# EAGLE design d-ampsch (EAGLE 9.5.2)

## Sheet 1 of 2: D-amp sch
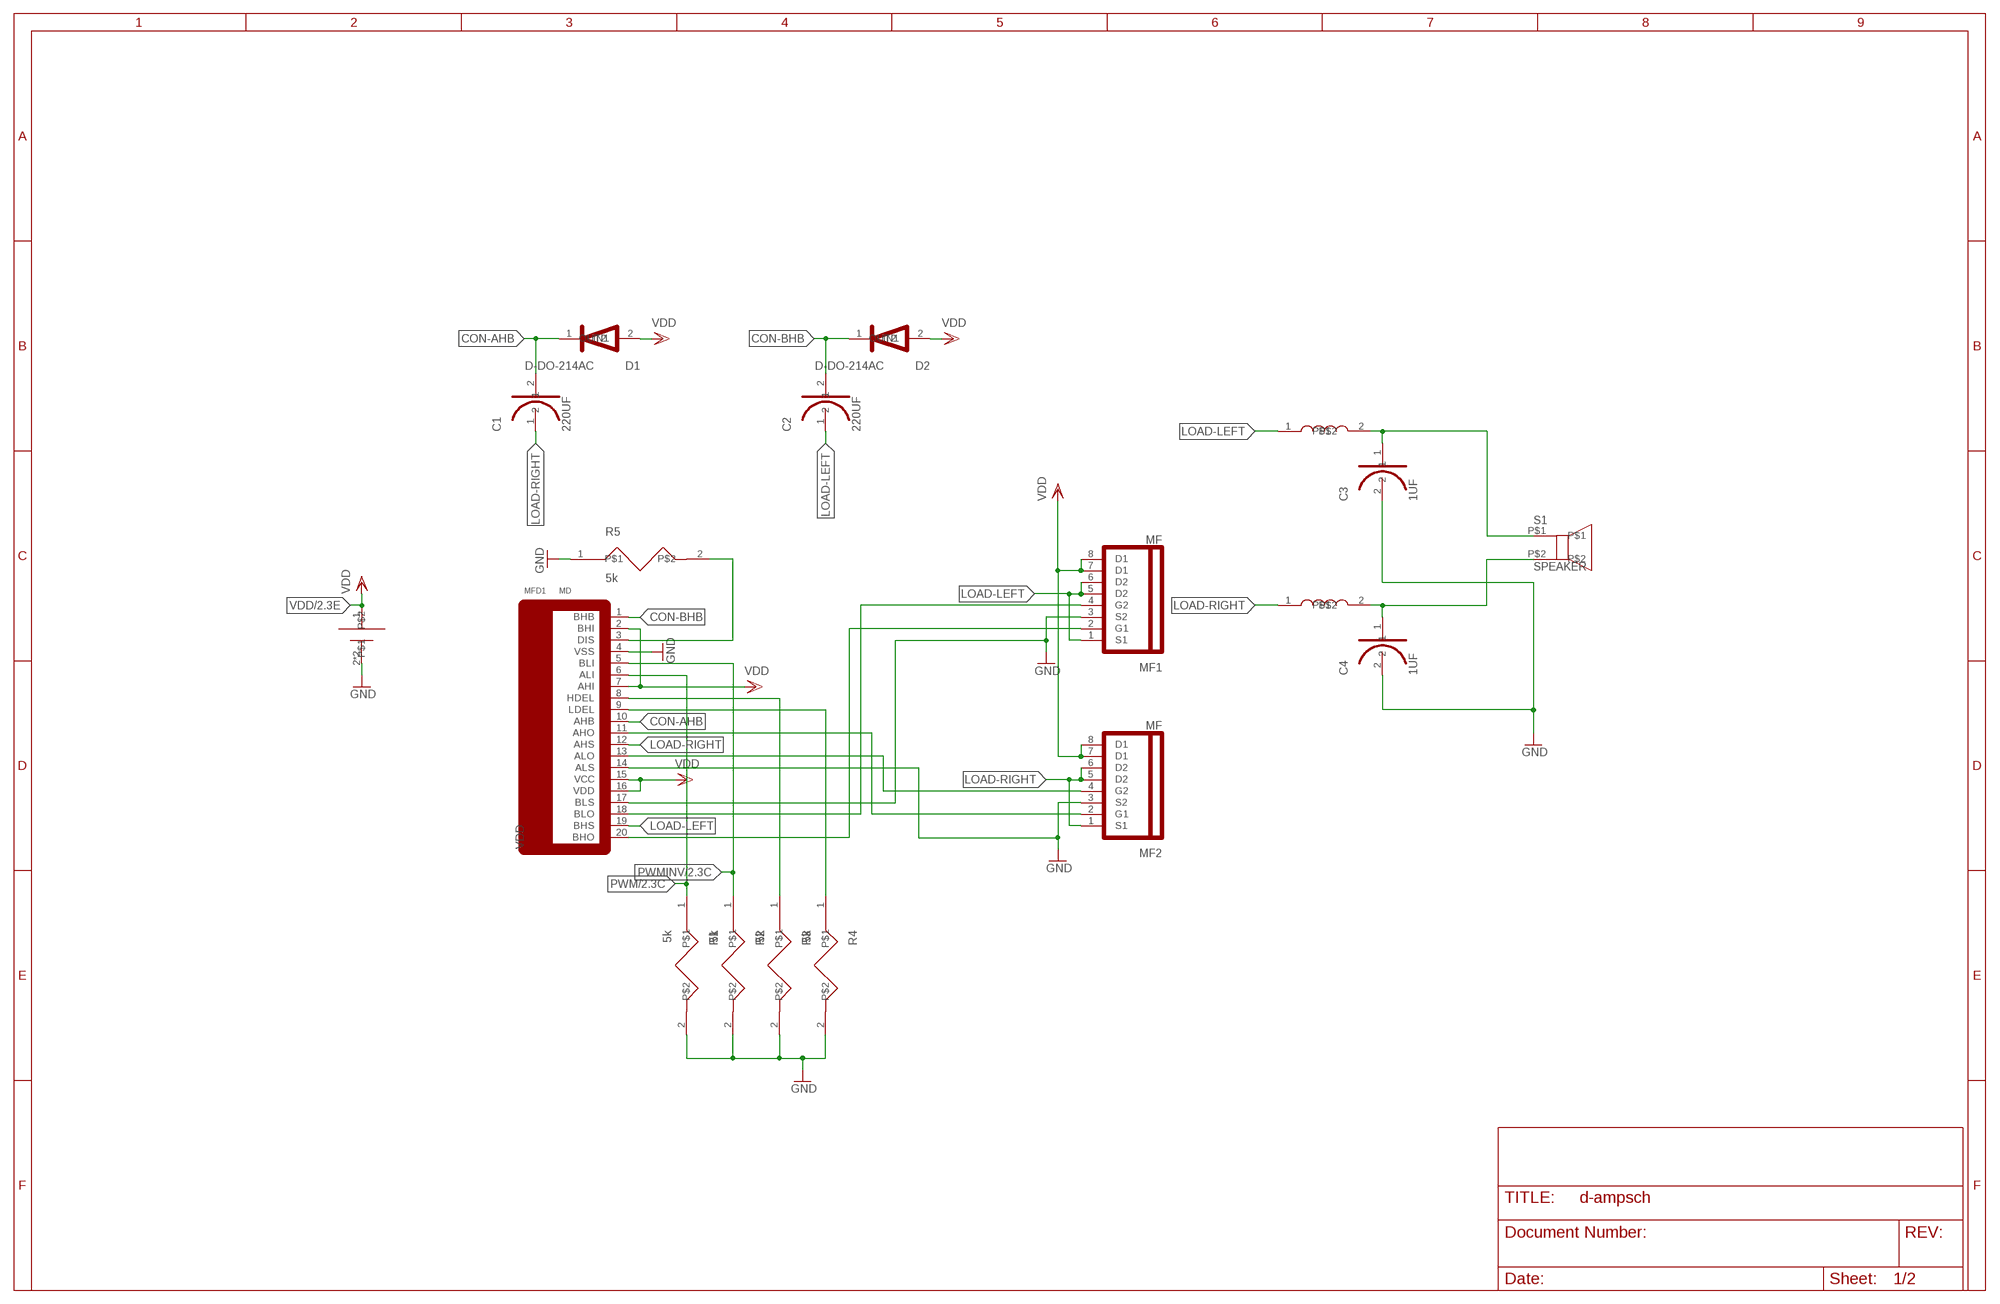
[diagram p0: schematic, sheet 1]

### Parts
C1  220UF  C-EEEFK1H221P-220UF  [CAPAE1030X1050N]
C2  220UF  C-EEEFK1H221P-220UF  [CAPAE1030X1050N]
C3  1UF  C-EEEHB1H1R0R-1UF  [CAPAE430X610N]
C4  1UF  C-EEEHB1H1R0R-1UF  [CAPAE430X610N]
D1  D-DO-214AC  [SOD5226X220N]
D2  D-DO-214AC  [SOD5226X220N]
MF1  MF  MF-PHN210T  [SOIC127P600X175-8N]
MF2  MF  MF-PHN210T  [SOIC127P600X175-8N]
MFD1  MD  MD-HIP4081AIBZ  [SOIC127P1032X265-20N]
R1  5k  R-RN73C2A4K99B-5K  [RESC2012X65N]
R2  5k  R-RN73C2A4K99B-5K  [RESC2012X65N]
R3  5k  R-RN73C2A4K99B-5K  [RESC2012X65N]
R4  5k  R-RN73C2A4K99B-5K  [RESC2012X65N]
R5  5k  R-RN73C2A4K99B-5K  [RESC2012X65N]
S1  SPEAKER  S-SPEAKER  [SPEAKER]
U$1  B-BATTERYBATTERYCONN  [DIODFN1710X1680X1100-3N]
U$21  I-WURTH-10UH  [INDDFN2751X2800X1540-3N]
U$22  I-WURTH-10UH  [INDDFN2751X2800X1540-3N]

### Nets
CON-AHB: C1.2 D1.1(IN1) MFD1.10(AHB)
CON-BHB: C2.2 D2.1(IN1) MFD1.1(BHB)
GND: C3.2 C4.2 MF1.3(S2) MF2.3(S2) MFD1.4(VSS) MFD1.14(ALS) MFD1.17(BLS) R1.2 R2.2 R3.2 R4.2 R5.1 U$1.2 U$1.3 ; also sheet 2
LOAD-LEFT: C2.1 MF1.1(S1) MF1.5(D2) MF1.6(D2) MFD1.19(BHS) U$21.1
LOAD-RIGHT: C1.1 MF2.1(S1) MF2.5(D2) MF2.6(D2) MFD1.12(AHS) U$22.1
N$1: MFD1.8(HDEL) R3.1
N$3: MFD1.9(LDEL) R4.1
N$5: MF1.2(G1) MFD1.20(BHO)
N$6: MF1.4(G2) MFD1.18(BLO)
N$7: MFD1.3(DIS) R5.2
N$8: C4.1 S1.P$2 U$22.2
N$9: MF2.2(G1) MFD1.11(AHO)
N$11: MF2.4(G2) MFD1.13(ALO)
N$12: C3.1 S1.P$1 U$21.2
PWM: MFD1.6(ALI) R1.1 ; also sheet 2
PWMINV: MFD1.5(BLI) R2.1 ; also sheet 2
VDD: D1.2(OUT2) D2.2(OUT2) MF1.7(D1) MF1.8(D1) MF2.7(D1) MF2.8(D1) MFD1.2(BHI) MFD1.7(AHI) MFD1.15(VCC) MFD1.16(VDD) U$1.1 ; also sheet 2

## Sheet 2 of 2: MCU BT SCH
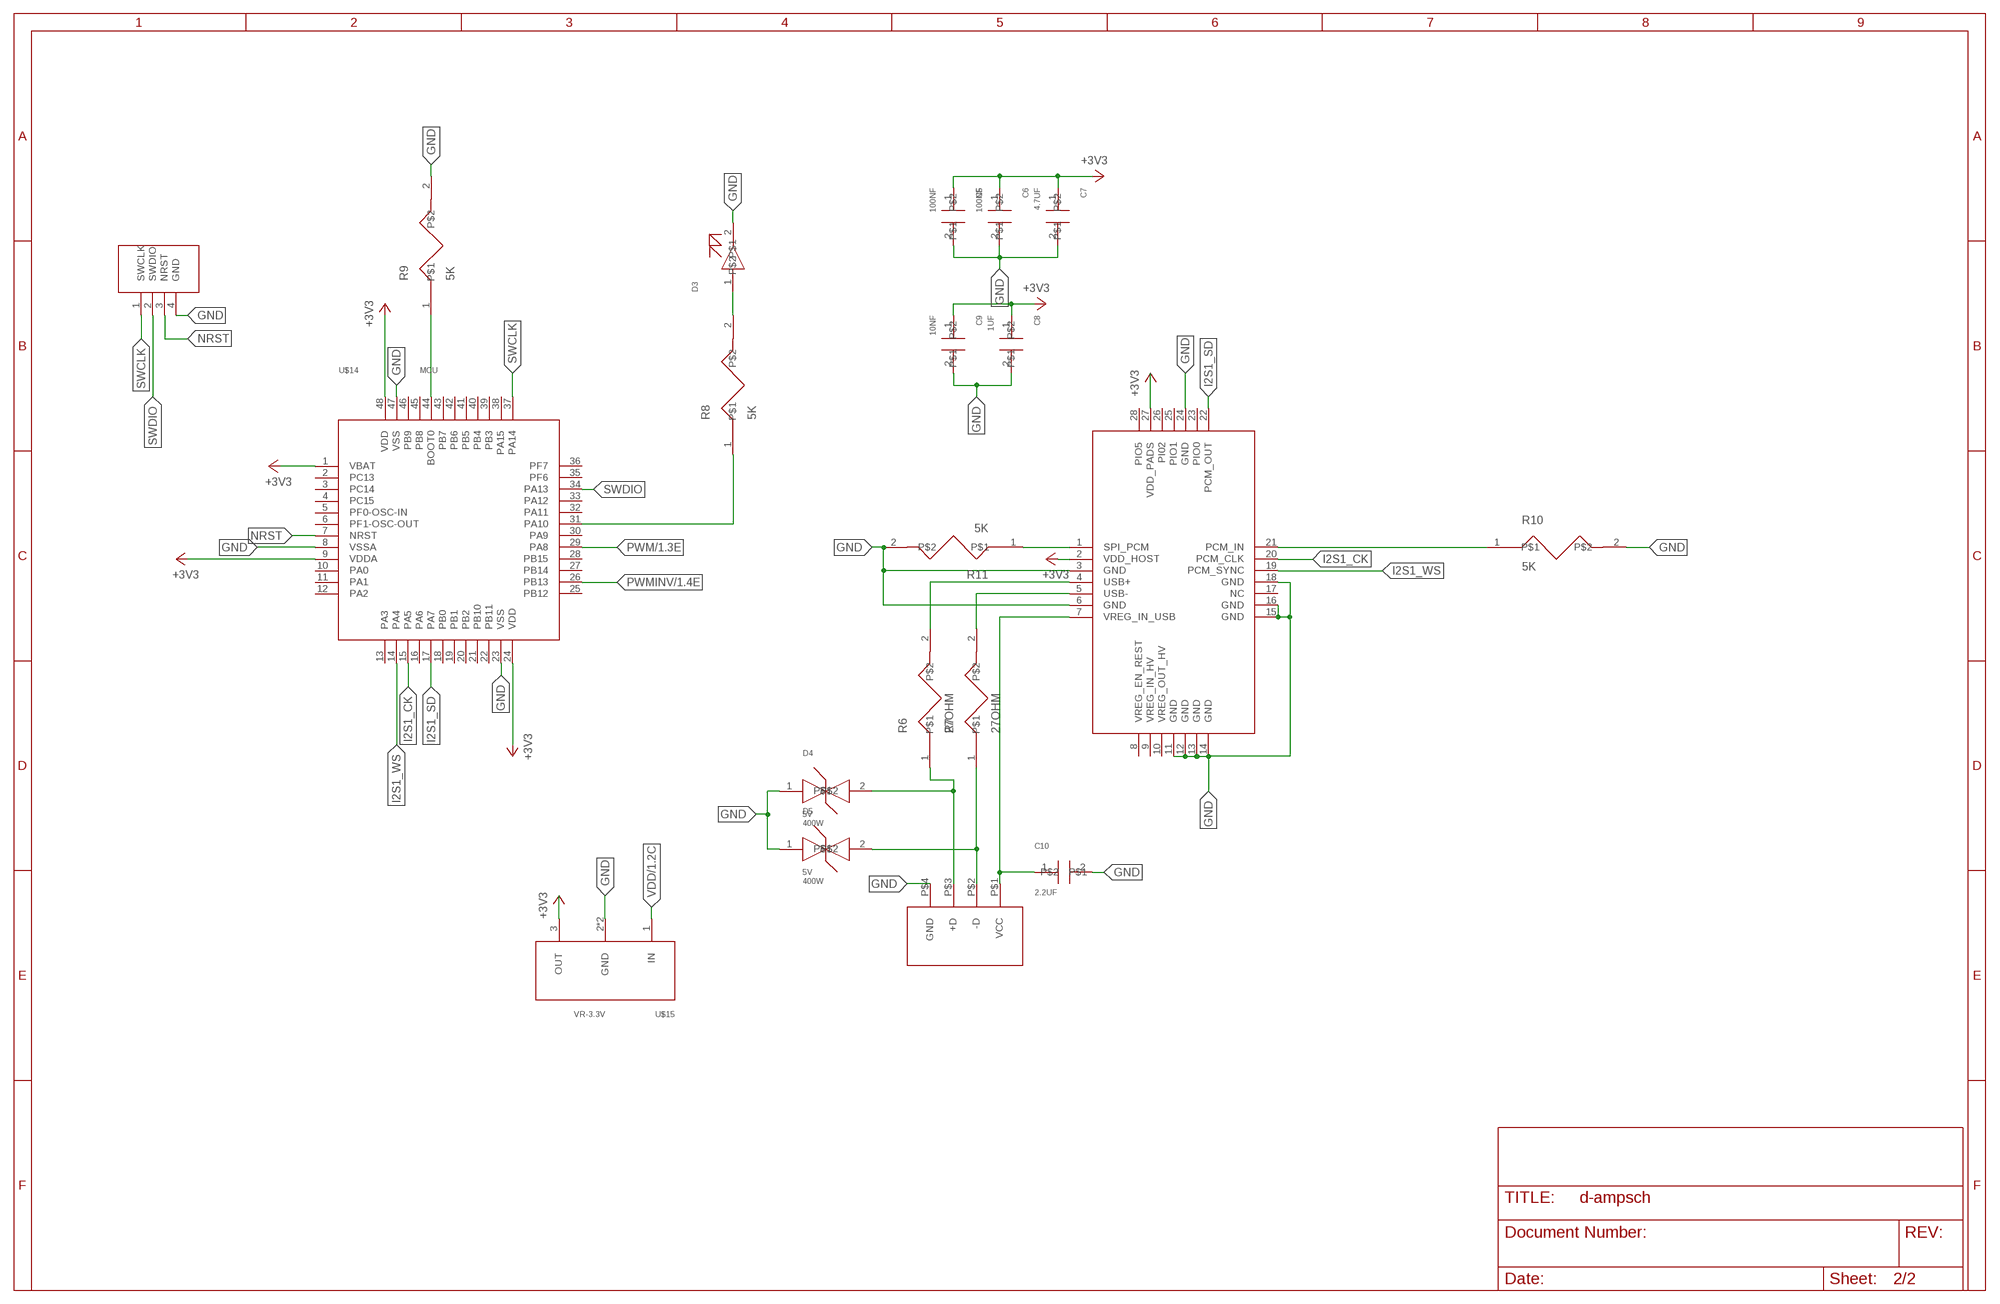
[diagram p1: schematic, sheet 2]

### Parts
C5  100NF  C-100NF  [CAPC2012X70N]
C6  100NF  C-100NF  [CAPC2012X70N]
C7  4.7UF  C-4.7UFC-4.7UF  [CAPC2012X145N]
C8  1UF  C-1UF-NPC-1UF-NP  [CAPC4532X70N]
C9  10NF  C-10NF  [CAPC2012X145N]
C10  2.2UF  CAP-2.2UF  [CAPC1632X100N]
D3  LED_GREEN  [LEDC3333X200N]
D4  BI-DIR-5V  [DIOM5126X229N]
D5  BI-DIR-5V  [DIOM5126X229N]
R6  27OHM  R-27OHM  [RESC2012X60N]
R7  27OHM  R-27OHM  [RESC2012X60N]
R8  5K  R-RN73C2A4K99B-5K  [RESC2012X65N]
R9  5K  R-RN73C2A4K99B-5K  [RESC2012X65N]
R10  5K  R-RN73C2A4K99B-5K  [RESC2012X65N]
R11  5K  R-RN73C2A4K99B-5K  [RESC2012X65N]
U$13  BLUETOOTH  [QFN80P850X1285X175-42N]
U$14  MCU  [QFP50P900X900X160-48N]
U$15  VR-3.3V  [SOT230P700X175-4N]
U$23  USB  [USB]
U$31  PROGRAMCONN  [HDRV4W50P200_1X4_840X220X710B]

### Nets
+3V3: C5.1 C6.1 C7.1 C8.1 C9.1 U$13.2(VDD_HOST) U$13.27(VDD_PADS) U$14.1(VBAT) U$14.9(VDDA) U$14.24(VDD) U$14.48(VDD) U$15.3(OUT)
GND: C5.2 C6.2 C7.2 C8.2 C9.2 C10.2 D3.2 D4.1 D5.1 R9.2 R10.2 R11.2 U$13.3(GND) U$13.6(GND) U$13.11(GND) U$13.12(GND) U$13.13(GND) U$13.14(GND) U$13.15(GND) U$13.16(GND) U$13.18(GND) U$13.24(GND) U$14.8(VSSA) U$14.23(VSS) U$14.47(VSS) U$15.2(GND) U$15.4(GND) U$23.P$4(GND) U$31.4(GND) ; also sheet 1
I2S1_CK: U$13.20(PCM_CLK) U$14.15(PA5)
I2S1_SD: U$13.22(PCM_OUT) U$14.17(PA7)
I2S1_WS: U$13.19(PCM_SYNC) U$14.14(PA4)
N$2: R11.1 U$13.1(SPI_PCM)
N$4: D4.2 R6.1 U$23.P$3(+D)
N$10: D5.2 R7.1 U$23.P$2(-D)
N$13: C10.1 U$13.7(VREG_IN_USB) U$23.P$1(VCC)
N$14: R7.2 U$13.5(USB-)
N$15: R6.2 U$13.4(USB+)
N$16: R10.1 U$13.21(PCM_IN)
N$17: R9.1 U$14.44(BOOT0)
N$18: D3.1 R8.2
N$19: R8.1 U$14.31(PA10)
NRST: U$14.7(NRST) U$31.3(NRST)
PWM: U$14.29(PA8) ; also sheet 1
PWMINV: U$14.26(PB13) ; also sheet 1
SWCLK: U$14.37(PA14) U$31.1(SWCLK)
SWDIO: U$14.34(PA13) U$31.2(SWDIO)
VDD: U$15.1(IN) ; also sheet 1
Unconnected: U$13.8(VREG_EN_REST) U$13.9(VREG_IN_HV) U$13.10(VREG_OUT_HV) U$13.17(NC) U$13.23(PIO0) U$13.25(PIO1) U$13.26(PI02) U$13.28(PIO5) U$14.2(PC13) U$14.3(PC14) U$14.4(PC15) U$14.5(PF0-OSC-IN) U$14.6(PF1-OSC-OUT) U$14.10(PA0) U$14.11(PA1) U$14.12(PA2) U$14.13(PA3) U$14.16(PA6) U$14.18(PB0) U$14.19(PB1) U$14.20(PB2) U$14.21(PB10) U$14.22(PB11) U$14.25(PB12) U$14.27(PB14) U$14.28(PB15) U$14.30(PA9) U$14.32(PA11) U$14.33(PA12) U$14.35(PF6) U$14.36(PF7) U$14.38(PA15) U$14.39(PB3) U$14.40(PB4) U$14.41(PB5) U$14.42(PB6) U$14.43(PB7) U$14.45(PB8) U$14.46(PB9)

## Library data of the parts
C1 C2 = amplib:C-EEEFK1H221P-220UF: EEEFK1H221P <https://docs.rs-online.com/919b/0900766b8139e2ba.pdf> RS-artikelnummer 537-0584 <https://se.rs-online.com/web/p/aluminium-capacitors/5370584/> 220uF
C3 C4 = amplib:C-EEEHB1H1R0R-1UF
C5 C6 = amplib:C-100NF: datasheet <https://docs.rs-online.com/af10/0900766b817076d9.pdf> RS-artikelnummer 264-4416 <https://se.rs-online.com/web/p/mlccs-multilayer-ceramic-capacitors/2644416/>
C7 = amplib:C-4.7UF: datasheet <https://docs.rs-online.com/c389/0900766b81714cd4.pdf> RS-artikelnummer 903-9105 <https://se.rs-online.com/web/p/mlccs-multilayer-ceramic-capacitors/9039105/>
C8 = amplib:C-1UF-NP: datasheet <https://docs.rs-online.com/72e0/0900766b80dc2409.pdf> RS-artikelnummer 698-3875 <https://se.rs-online.com/web/p/mlccs-multilayer-ceramic-capacitors/6983875/>
C9 = amplib:C-10NF: datasheet <https://docs.rs-online.com/9e65/0900766b8104796c.pdf> RS-artikelnummer 751-2226 <https://se.rs-online.com/web/p/mlccs-multilayer-ceramic-capacitors/7512226/>
C10 = amplib:CAP-2.2UF: datasheet <https://docs.rs-online.com/1d1a/0900766b815c8acd.pdf> RS-artikelnummer 144-1960 <https://se.rs-online.com/web/p/mlccs-multilayer-ceramic-capacitors/1441960/>
D1 D2 = amplib:D-DO-214AC: DO-214AC <https://docs.rs-online.com/8928/0900766b812212c7.pdf> RS-artikelnummer 781-1122 <https://se.rs-online.com/web/p/rectifier-diodes-schottky-diodes/7811122/>
D3 = amplib:LED_GREEN: datasheet <https://docs.rs-online.com/7395/0900766b812d394e.pdf> RS-artikelnummer 810-6822 <https://se.rs-online.com/web/p/leds/8106822/>
D4 D5 = amplib:BI-DIR-5V: datasheet <https://docs.rs-online.com/73d6/0900766b810f4edb.pdf> RS-artikelnummer 764-5568 <https://se.rs-online.com/web/p/tvs-diodes/7645568/>
MF1 MF2 = amplib:MF-PHN210T: PHN210T <https://www.renesas.com/eu/en/www/doc/datasheet/hip4081a.pdf> RS-artikelnummer 725-8376 <https://se.rs-online.com/web/p/mosfets/7258376/>
MFD1 = amplib:MD-HIP4081AIBZ: HIP4081AIBZ <https://www.renesas.com/eu/en/www/doc/datasheet/hip4081a.pdf> RS-artikelnummer 216-3484 <https://se.rs-online.com/web/p/mosfet-drivers/2163484/>
R1-R5 R8-R11 = amplib:R-RN73C2A4K99B-5K: datasheet <https://docs.rs-online.com/96b9/0900766b81488572.pdf> RS-artikelnummer 215-3162 <https://se.rs-online.com/web/p/surface-mount-fixed-resistors/2153162/>
R6 R7 = amplib:R-27OHM
S1 = amplib:S-SPEAKER
U$1 = amplib:B-BATTERY: acdcadapter, RS-artikelnummer 121-7132 <https://se.rs-online.com/web/p/ac-dc-adapters/1217132/> RS-artikelnummer 476-157 <https://se.rs-online.com/web/p/dc-power-sockets/0476157/> datasheet <https://docs.rs-online.com/560d/0900766b815825c1.pdf>
U$13 = amplib:BLUETOOTH: datasheet <https://www.mouser.se/datasheet/2/986/Datasheet_-_BT800_Module-1590704.pdf> Mouser No: 239-BT800 <https://www.mouser.se/ProductDetail/Laird-Connectivity/BT800?qs=sGAEpiMZZMsGelYiB%252BjhZkkHhaJQb1s%252BFpdjxxQrm%2FVzv2ACM1FW4w==>
U$14 = amplib:MCU: datasheet <https://www.mouser.se/datasheet/2/389/stm32f031c4-956179.pdf> Mouser No: 511-STM32F031C4T6 <https://www.mouser.se/ProductDetail/STMicroelectronics/STM32F031C4T6?qs=sGAEpiMZZMuoKKEcg8mMKJe7FkJ93gBlEVQCkIXRNi2EOhU3M8GXsA%3D%3D>
U$15 = amplib:VR-3.3V: datasheet <https://docs.rs-online.com/ddd1/0900766b813ed0b7.pdf> RS-artikelnummer 757-7190 <https://se.rs-online.com/web/p/linear-voltage-regulators/7577190/>
U$21 U$22 = amplib:I-WURTH-10UH
U$23 = amplib:USB: datasheet <https://docs.rs-online.com/0507/0900766b81711f60.pdf> RS-artikelnummer 909-7864 <https://se.rs-online.com/web/p/type-a-usb-connectors/9097864/>
U$31 = amplib:PROGRAMCONN: datasheet <https://docs.rs-online.com/9df3/0900766b80e352b0.pdf> RS-artikelnummer 701-9862 <https://se.rs-online.com/web/p/pcb-pin-socket-strips/7019862/>

## Net classes
0 default: clearance 0.205 mm

## Board
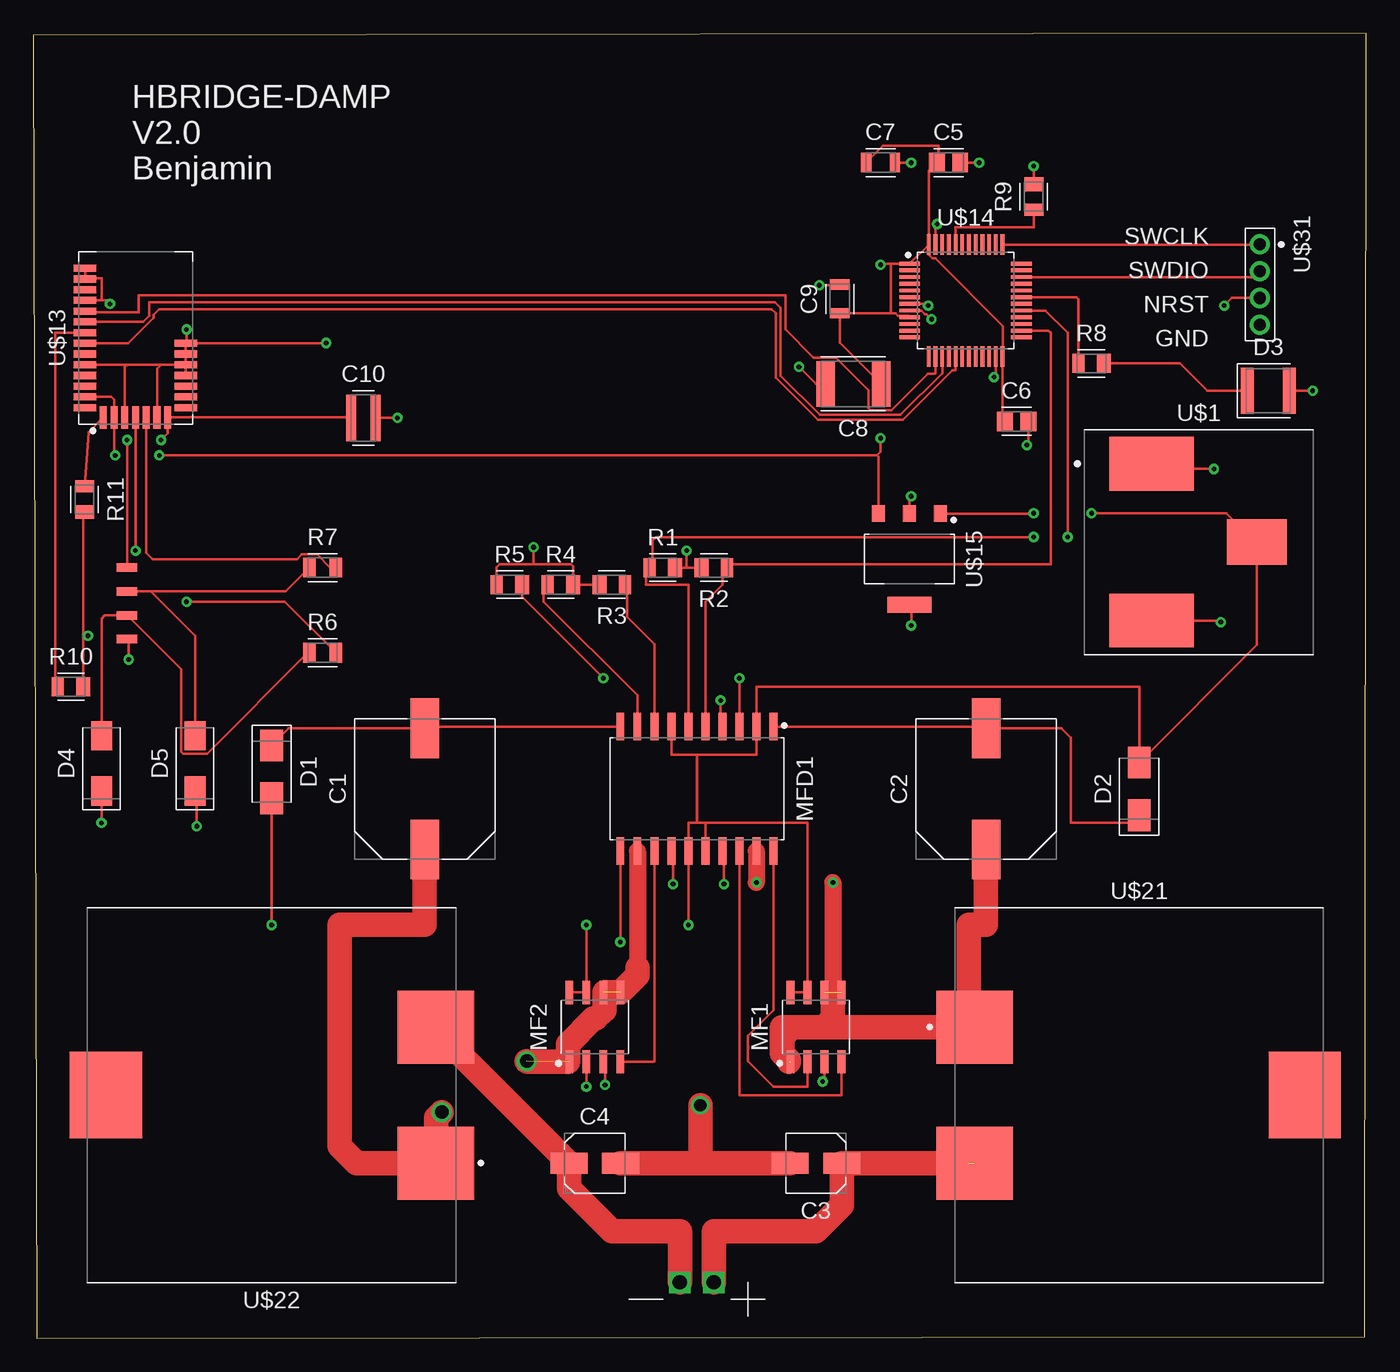
[diagram p2: board, top side]
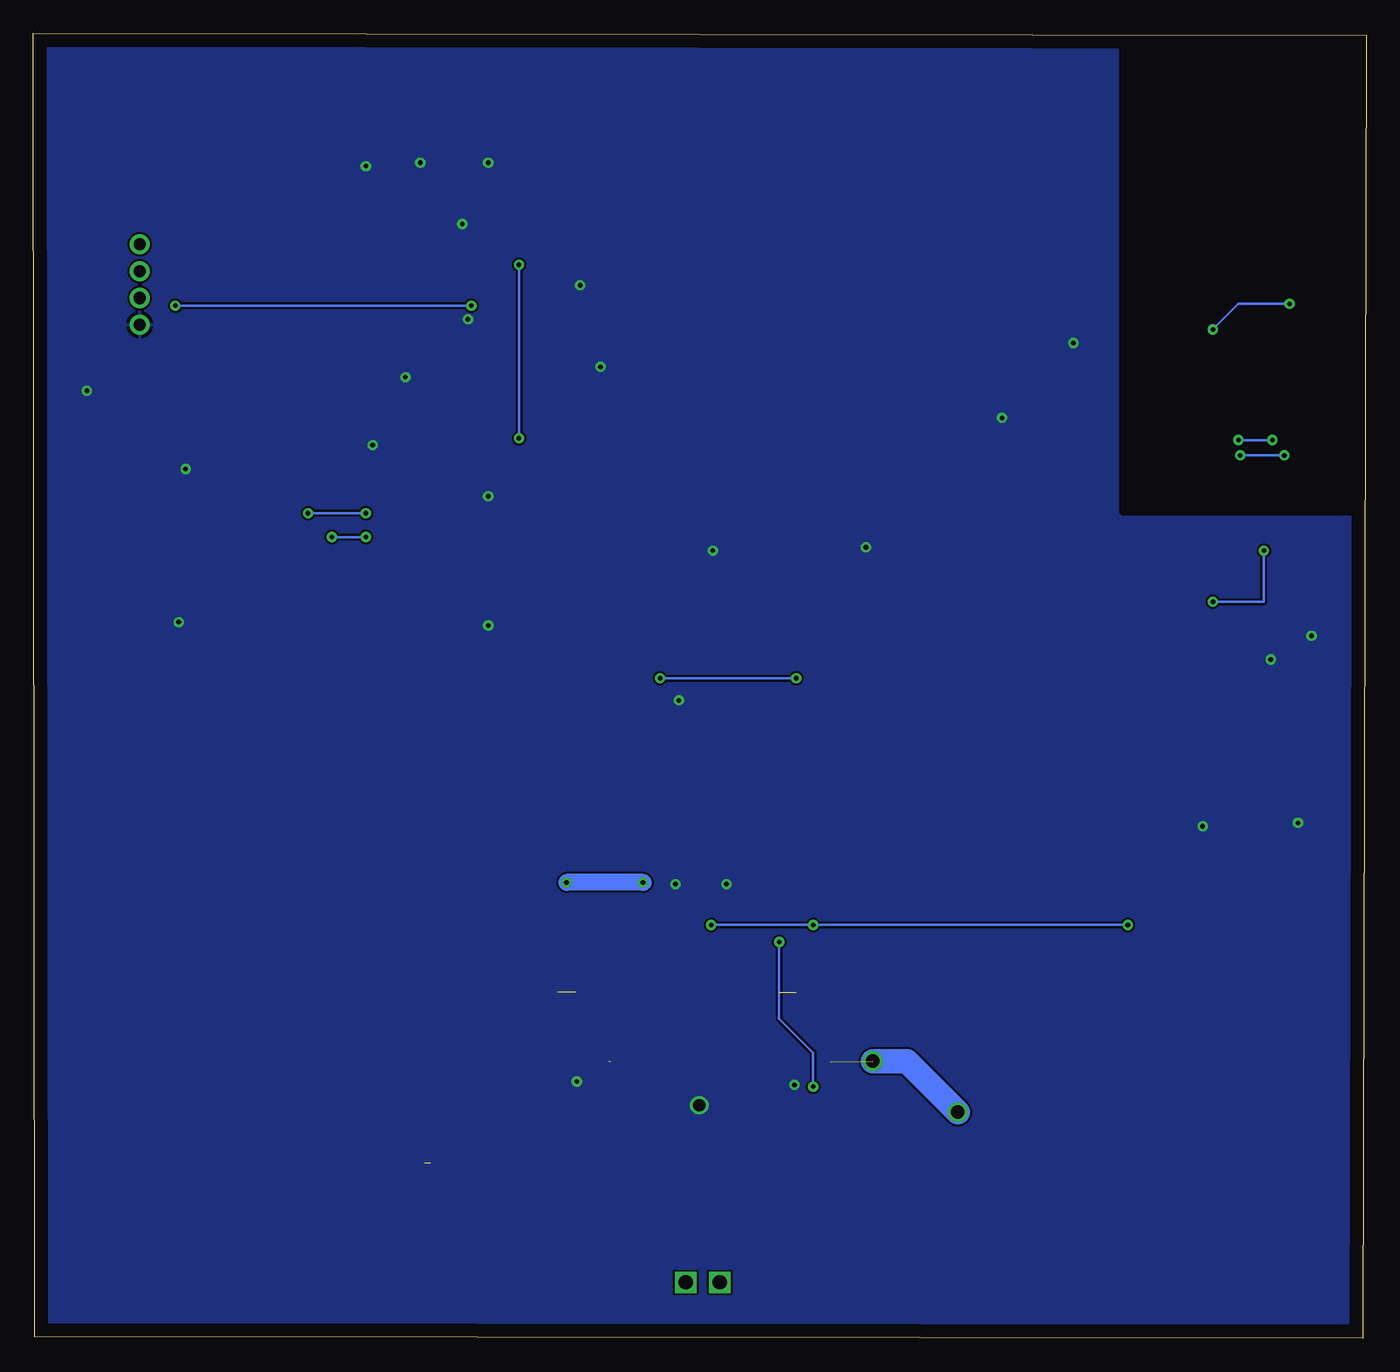
[diagram p3: board, bottom side, seen from below]

Size 99.49 x 97.4 mm. Coordinates in mm from the lower left corner, seen from the top.
Outline: 0.25,0 99.39,0.13 99.49,97.4 0,97.27 0.25,0
Copper layers (1*16): Top 0.035mm / dielectric 1.5mm / Bottom 0.035mm
Design rules "default *": minimum track width 6mil, minimum drill 0.35mm, track to track 6mil, track to pad 6mil, pad to pad 6mil, via to via 6mil, smd to smd 6mil, copper to edge 40mil, drill to drill 6mil, minimum pad ring 10mil, minimum via ring 8mil, stop-mask expansion 4mil, vias tented up to drill 0mil, thermal gap 10mil

### Footprints (pad centres in the part's own frame; a part is rotated, then mirrored left to right if it is on the bottom)
CAPAE1030X1050N = smd 4.462 x 2.115: 1 -4.525,0; 2 4.525,0
CAPAE430X610N = smd 2.762 x 1.579: 1 -1.925,0; 2 1.925,0
CAPC2012X70N = smd 1.165 x 1.465: 1 -0.875,0; 2 0.875,0
CAPC2012X145N = smd 0.765 x 1.465: 1 -1.075,0; 2 1.075,0
CAPC4532X70N = smd 1.368 x 3.415: 1 -2.071,0; 2 2.071,0
CAPC1632X100N = smd 0.742 x 3.462: 1 -0.91,0; 2 0.91,0
SOD5226X220N = smd 2.365 x 1.707: 1 -1.966,0; 2 1.966,0
LEDC3333X200N = smd 0.962 x 3.412: 1 -1.575,0; 2 1.575,0
DIOM5126X229N = smd 2.175 x 1.565: 1 -2.061,0; 2 2.061,0
SOIC127P600X175-8N = smd 1.746 x 0.592: 1 -2.585,1.905; 2 -2.585,0.635; 3 -2.585,-0.635; 4 -2.585,-1.905; 5 2.585,-1.905; 6 2.585,-0.635; 7 2.585,0.635; 8 2.585,1.905
SOIC127P1032X265-20N = smd 2.052 x 0.589: 1 -4.654,5.715; 2 -4.654,4.445; 3 -4.654,3.175; 4 -4.654,1.905; 5 -4.654,0.635; 6 -4.654,-0.635; 7 -4.654,-1.905; 8 -4.654,-3.175; 9 -4.654,-4.445; 10 -4.654,-5.715; 11 4.654,-5.715; 12 4.654,-4.445; 13 4.654,-3.175; 14 4.654,-1.905; 15 4.654,-0.635; 16 4.654,0.635; 17 4.654,1.905; 18 4.654,3.175; 19 4.654,4.445; 20 4.654,5.715
RESC2012X65N = smd 0.9 x 1.417: 1 -0.985,0 | smd 1.031 x 1.417: 2 0.919,0
RESC2012X60N = smd 0.935 x 1.465: 1 -0.99,0; 2 0.99,0
SPEAKER = drill 1.067 square: P$1 0,0; P$2 2.54,0
DIODFN1710X1680X1100-3N = smd 4.512 x 3.412: 1 4.344,0 | smd 6.312 x 4.012: 2 -3.5,5.85; 3 -3.5,-5.85
QFN80P850X1285X175-42N = smd 1.687 x 0.532: 1 -5.937,2.4; 2 -5.937,1.6; 3 -5.937,0.8; 4 -5.937,0; 5 -5.937,-0.8; 6 -5.937,-1.6; 7 -5.937,-2.4 | smd 0.532 x 1.687: 8 -5.2,-3.762; 9 -4.4,-3.762; 10 -3.6,-3.762; 11 -2.8,-3.762; 12 -2,-3.762; 13 -1.2,-3.762; 14 -0.4,-3.762; 15 5.2,3.762; 16 4.4,3.762; 17 3.6,3.762; 18 2.8,3.762; 19 2,3.762; 20 1.2,3.762; 21 0.4,3.762; 22 -0.4,3.762; 23 -1.2,3.762; 24 -2,3.762; 25 -2.8,3.762; 26 -3.6,3.762; 27 -4.4,3.762; 28 -5.2,3.762
QFP50P900X900X160-48N = smd 1.559 x 0.28: 1 -4.178,2.75; 2 -4.178,2.25; 3 -4.178,1.75; 4 -4.178,1.25; 5 -4.178,0.75; 6 -4.178,0.25; 7 -4.178,-0.25; 8 -4.178,-0.75; 9 -4.178,-1.25; 10 -4.178,-1.75; 11 -4.178,-2.25; 12 -4.178,-2.75; 25 4.178,-2.75; 26 4.178,-2.25; 27 4.178,-1.75; 28 4.178,-1.25; 29 4.178,-0.75; 30 4.178,-0.25; 31 4.178,0.25; 32 4.178,0.75; 33 4.178,1.25; 34 4.178,1.75; 35 4.178,2.25; 36 4.178,2.75 | smd 0.28 x 1.559: 13 -2.75,-4.178; 14 -2.25,-4.178; 15 -1.75,-4.178; 16 -1.25,-4.178; 17 -0.75,-4.178; 18 -0.25,-4.178; 19 0.25,-4.178; 20 0.75,-4.178; 21 1.25,-4.178; 22 1.75,-4.178; 23 2.25,-4.178; 24 2.75,-4.178; 37 2.75,4.178; 38 2.25,4.178; 39 1.75,4.178; 40 1.25,4.178; 41 0.75,4.178; 42 0.25,4.178; 43 -0.25,4.178; 44 -0.75,4.178; 45 -1.25,4.178; 46 -1.75,4.178; 47 -2.25,4.178; 48 -2.75,4.178
SOT230P700X175-4N = smd 1.21 x 0.971: 1 -3.4,2.3; 2 -3.4,0; 3 -3.4,-2.3 | smd 1.21 x 3.28: 4 3.4,0
INDDFN2751X2800X1540-3N = smd 5.702 x 5.442: 1 -12.273,5.075; 2 -12.273,-5.075 | smd 5.392 x 6.462: 3 12.372,0
USB = smd 0.635 x 1.524: P$1 0,0; P$2 1.778,0; P$3 3.556,0; P$4 5.334,0
HDRV4W50P200_1X4_840X220X710B = drill 0.907 pad 1.507: 1 0,0; 2 2,0; 3 4,0; 4 6,0

### Placement (x,y rotation side)
C1  29.21,41.02 90 top
C2  71.12,41.02 90 top
C3  58.42,13.08 180 top
C4  41.91,13.08 0 top
C5  68.33,87.76 0 top
C6  73.41,68.45 0 top
C7  63.25,87.76 0 top
C8  61.21,71.25 180 top
C9  60.2,77.6 90 top
C10  24.64,68.71 0 top
D1  17.78,42.29 270 top
D2  82.55,41.02 90 top
D3  92.2,70.74 0 top
D4  5.08,42.93 90 top
D5  12.06,42.93 90 top
MF1  58.42,23.24 90 top
MF2  41.91,23.24 90 top
MFD1  49.53,41.02 270 top
R1  46.99,57.53 0 top
R2  50.8,57.53 180 top
R3  43.18,56.26 180 top
R4  39.37,56.26 0 top
R5  35.56,56.26 0 top
R6  21.59,51.18 0 top
R7  21.59,57.53 0 top
R8  78.99,72.77 0 top
R9  74.68,85.22 90 top
R10  2.79,48.64 0 top
R11  3.81,62.61 270 top
S1  50.8,4.19 180 top
U$1  87,59.44 0 top
U$13  7.62,74.68 90 top
U$14  69.6,77.47 0 top
U$15  65.41,58.17 270 top
U$21  82.55,18.16 0 top
U$22  17.78,18.16 180 top
U$23  6.99,57.53 270 top
U$31  91.57,81.66 270 top

### Tracks (layer width: path | path; a pad name or v marks a point on that pad's centre or on a via)
+3V3  (via drill 0.35)
  Top 0.2: v6.1,65.91 6.02,65.99 U$13.2 6.02,70.05 5.8,70.28 U$13.27 | v9.4,65.91 62.99,65.91 | 62.99,65.91 63.1,65.8 U$15.3 | 64.01,80.22 U$14.1 U$14.48 | 64.01,80.22 63.33,80.22 v63.25,80.14 | v63.25,67.18 63.25,66.17 62.99,65.91 | C7.1 63.44,89.03 67.56,89.03 67.56,87.87 C5.1 66.85,87.15 U$14.48 | C8.1 60.2,74.33 C9.1 64.01,76.52 | U$14.9 65.31,76.33 64.53,76.33 64.34,76.52 64.01,76.52 | 64.01,80.22 64.01,76.52 | U$14.48 66.85,80.87 67.1,80.62 67.34,80.62 72.39,75.56 72.39,73.34 U$14.24 72.35,68.64 C6.1
  Bottom 0.2: v6.1,65.91 v9.4,65.91 | v63.25,80.14 v63.25,67.18
CON-AHB
  Top 0.2: MFD1.10 29.34,45.67 C1.2 19.07,45.55 D1.1
CON-BHB
  Top 0.2: MFD1.1 70.99,45.67 C2.2 76.75,45.55 77.47,44.83 77.47,38.48 81.98,38.48 D2.1
GND  (via drill 0.35, 0.9)
  Top 0.2: U$13.14 U$13.13 U$13.12 | U$13.12 U$13.11 | U$13.24 6.99,72.68 | 6.99,72.68 9.53,72.68 | 9.53,72.68 U$13.12 | U$13.18 5.08,77.48 | U$13.15 U$13.16 3.9,79.12 5.08,79.12 5.08,77.48 | v11.43,75.31 11.43,74.32 U$13.14 | 5.08,77.48 5.46,77.48 v5.71,77.22 | U$13.6 9.22,72.37 9.53,72.68 | U$13.3 6.82,72.51 6.99,72.68 | C7.2 v65.53,87.76 | C5.2 v70.61,87.76 | R9.2 v74.68,87.5 | U$14.47 67.35,83.05 v67.48,83.19 | U$14.23 71.85,71.89 v71.72,71.75 | U$14.8 66.28,76.72 66.54,76.46 66.67,76.46 v67.06,76.07 | C9.2 60.14,78.61 v58.67,78.61 | C8.2 58.42,71.25 v57.15,72.52 | C6.2 74.28,66.79 v74.17,66.67 | U$1.2 83.88,64.9 v88.14,64.9 | U$1.3 88.53,53.59 v88.65,53.47 | D3.2 v95.5,70.74 | C10.2 v27.18,68.71 | U$23.P$4 7.11,52.07 v7.11,50.67 | v4.06,52.45 3.71,52.1 R10.2 3.71,61.5 R11.2 | D4.1 v5.08,38.48 | D5.1 12.19,40.74 v12.19,38.23 | R5.1 34.58,57.56 34.8,57.79 37.34,57.79 | 37.34,57.79 40.13,57.79 40.29,57.63 R4.2 R3.2 | 37.34,57.79 v37.34,59.05 | R1.2 48.77,57.53 | 48.77,57.53 R2.2 | 48.77,57.53 v48.77,58.8 | U$15.4 65.53,54.64 v65.53,53.21 | U$15.2 65.41,62.74 v65.53,62.87 | MFD1.4 51.31,45.8 v51.31,47.62 | MFD1.14 47.75,36.24 v47.75,33.91 | MFD1.17 51.56,36.24 v51.56,33.91 | MF2.3 42.67,20.53 v42.67,18.92 | U$13.14 11.4,74.3 v21.84,74.3 | MF1.3 59.05,19.3 v58.93,19.18
  Top 1.829: C4.2 49.78,13.08 | 49.78,13.08 C3.2 | 49.78,13.08 v49.78,17.4
  Bottom 0.2: v5.71,77.22 9.53,77.22 v11.43,75.31
  pour Bottom: 19.56,96.9 99.06,96.9 99.06,0.64 0.76,0.64 0.76,61.34 18.29,61.34 18.54,61.59 18.54,96.9
I2S1_CK
  Top 0.2: U$13.20 8.19,75.88 8.64,76.33 8.64,77.34 55.37,77.34 55.78,76.93 55.78,71.86 58.71,68.94 64.73,68.94 67.85,72.05 U$14.15
I2S1_SD
  Top 0.2: U$13.22 7.08,74.28 8.99,76.18 8.99,76.42 9.4,76.83 55.12,76.83 55.43,76.52 55.43,71.71 58.56,68.58 64.91,68.58 68.59,72.26 68.83,72.26 68.85,72.28 U$14.17
I2S1_WS
  Top 0.2: U$13.19 3.95,76.58 7.87,76.58 7.87,77.85 56.13,77.85 56.13,75.31 58.24,73.21 59.93,73.21 62.35,70.79 62.35,69.44 62.5,69.29 64.07,69.29 66.8,72.01 67.31,72.01 67.35,72.05 U$14.14
LOAD-LEFT  (via drill 0.35)  (2 unrouted)
  Top 0.2: MF1.1 56.73,20.87 56.73,22.14 59.05,24.47 MF1.6
  Top 1.27: MFD1.19 v53.98,34.04 | v59.69,34.04 59.69,25.78
  Top 1.829: C2.1 71.12,30.86 69.85,30.86 69.85,23.66 U$21.1 59.7,23.24 | 59.7,23.24 59.69,23.24 59.69,25.78 | 59.7,23.24 55.88,23.24 55.88,21.29 56.42,20.75 56.42,20.66
  Bottom 1.27: v53.98,34.04 v59.69,34.04
LOAD-RIGHT  (via drill 1)  (2 unrouted)
  Top 1.27: MFD1.12 45.09,27.69
  Top 1.829: C1.1 29.21,30.86 22.86,30.86 22.86,14.35 24.13,13.08 U$22.1 30.05,16.46 v30.48,16.89 | 45.09,27.69 45.09,27.1 MF2.5 42.64,25.83 42.64,24.51 42.01,23.89 41.83,23.89 39.91,21.97 39.91,20.66 36.88,20.66 v36.83,20.7
  Bottom 1.829: v30.48,16.89 34.29,20.7 v36.83,20.7
N$1
  Top 0.2: R3.1 44.31,56.12 44.31,53.86 46.35,51.82 MFD1.8
N$2
  Top 0.2: R11.1 4.13,67.65 U$13.1
N$3
  Top 0.2: MFD1.9 45.09,48.01 38.1,54.99 38.1,55.98 R4.1
N$4
  Top 0.2: D4.2 5.08,53.72 5.33,53.98 U$23.P$3 11.03,49.93 11.03,43.8 11.18,43.65 12.95,43.65 20.49,51.18 R6.1
N$5
  Top 0.2: MFD1.20 55.24,24.51 53.34,22.61 53.34,20.7 55.24,18.8 57.78,18.8 MF1.2
N$6
  Top 0.2: MFD1.18 52.7,18.16 60.33,18.16 MF1.4
N$7  (via drill 0.35)
  Top 0.2: MFD1.3 v52.7,49.28 | v42.55,49.28 36.48,55.34 R5.2
  Bottom 0.2: v52.7,49.28 v42.55,49.28
N$8
  Top 1.829: S1.P$2 48.26,8 43.18,8 39.98,11.2 C4.1 31.09,21.97 31.09,22.19 U$22.2
N$9  (via drill 0.35)
  Top 0.2: MFD1.11 v43.81,29.59 | v41.27,18.8 MF2.2
  Bottom 0.2: v43.81,29.59 43.81,23.88 41.27,21.34 v41.27,18.8
N$10
  Top 0.2: D5.2 12.06,52.45 8.76,55.75 U$23.P$2 18.82,55.75 R7.1
N$11
  Top 0.2: MFD1.13 46.35,20.7 46.31,20.66 MF2.4
N$12  (1 unrouted)
  Top 1.829: S1.P$1 50.8,8 58.42,8 60.34,9.93 C3.1 69.85,13.08
N$13  (via drill 0.35)
  Top 0.2: v9.53,67.06 10.02,67.55 U$13.7 23.7,68.74 C10.1 | v6.99,67.06 U$23.P$1
  Bottom 0.2: v9.53,67.06 v6.99,67.06
N$14
  Top 0.2: R7.2 22.16,57.53 21.17,58.52 20.03,58.52 19.68,58.17 8.89,58.17 8.42,58.64 U$13.5
N$15  (via drill 0.35)
  Top 0.2: R6.2 18.77,54.99 v11.43,54.99 | v7.62,58.8 U$13.4
  Bottom 0.2: v11.43,54.99 7.62,54.99 v7.62,58.8
N$16
  Top 0.2: U$13.21 3.84,75.06 1.62,75.06 1.62,48.64 R10.1
N$17
  Top 0.2: U$14.44 68.83,81.66 68.83,82.93 74.68,82.93 R9.1
N$18
  Top 0.2: R8.2 85.6,72.77 87.63,70.74 D3.1
N$19
  Top 0.2: U$14.31 77.86,77.72 78.01,77.57 R8.1
NRST  (via drill 0.35)
  Top 0.2: U$14.7 66.67,77.22 v66.8,77.09 | v88.9,77.09 89.47,77.66 U$31.3
  Bottom 0.2: v66.8,77.09 v88.9,77.09
PWM  (via drill 0.35)
  Top 0.2: MFD1.6 48.9,56.26 45.72,56.26 45.72,57.25 R1.1 46.23,57.75 46.23,59.56 46.48,59.82 v74.68,59.82 | v77.22,59.82 77.22,75.06 75.55,76.72 U$14.29
  Bottom 0.2: v74.68,59.82 v77.22,59.82
PWMINV
  Top 0.2: MFD1.5 50.16,54.99 51.44,56.26 51.44,57.18 R2.1 52.04,57.79 75.95,57.79 75.95,75.06 75.78,75.22 U$14.26
SWCLK
  Top 0.2: U$14.37 91.55,81.65 U$31.1
SWDIO
  Top 0.2: U$14.34 91.13,79.22 U$31.2
VDD  (via drill 0.35)
  Top 0.2: MFD1.7 47.62,43.56 49.53,43.56 | 49.53,43.56 53.98,43.56 MFD1.2 53.98,48.64 82.55,48.64 D2.2 91.34,51.78 91.34,59.31 | MFD1.16 50.16,38.48 | 50.16,38.48 49.53,38.48 | 49.53,38.48 48.9,38.48 MFD1.15 v48.9,30.86 | 49.53,38.48 49.53,43.56 | v41.27,30.86 MF2.7 MF2.8 | v17.78,30.86 D1.2 | MF1.8 MF1.7 57.78,38.48 50.16,38.48 | U$1.1 91.34,59.31 | U$15.1 74.65,61.57 v74.68,61.59 | v78.99,61.59 89.05,61.59 91.34,59.31
  Bottom 0.2: v48.9,30.86 v41.27,30.86 v17.78,30.86 | v74.68,61.59 v78.99,61.59

### Text on the board
tNames: HBRIDGE-DAMP / V2.0 / Benjamin